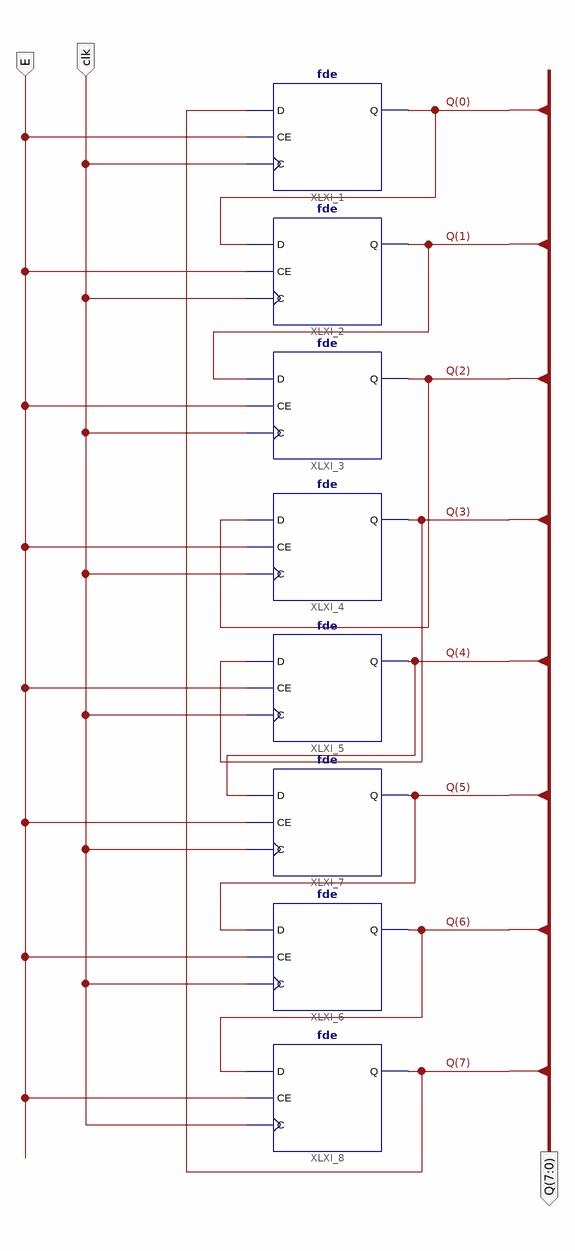
[diagram p0: schematic sheet 1]
// Xilinx ISE schematic shiftled.sch (spartan6) as structural Verilog: 8 symbols, 3 ports
module shiftled (
  input  clk,
  input  E,
  output [7:0] Q
);

  fde #(.INIT("1")) XLXI_1 (.C(clk), .CE(E), .D(Q[7]), .Q(Q[0]));
  fde XLXI_3 (.C(clk), .CE(E), .D(Q[1]), .Q(Q[2]));
  fde XLXI_2 (.C(clk), .CE(E), .D(Q[0]), .Q(Q[1]));
  fde XLXI_4 (.C(clk), .CE(E), .D(Q[2]), .Q(Q[3]));
  fde XLXI_5 (.C(clk), .CE(E), .D(Q[3]), .Q(Q[4]));
  fde XLXI_6 (.C(clk), .CE(E), .D(Q[5]), .Q(Q[6]));
  fde XLXI_7 (.C(clk), .CE(E), .D(Q[4]), .Q(Q[5]));
  fde XLXI_8 (.C(clk), .CE(E), .D(Q[6]), .Q(Q[7]));
endmodule
